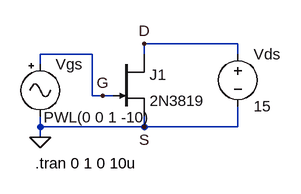
[diagram p0: schematic Draft2.asc]
Draft2.asc, the LTspice schematic file:
Version 4
SHEET 1 880 680
WIRE 384 96 240 96
WIRE 160 112 80 112
WIRE 240 112 240 96
WIRE 384 112 384 96
WIRE 80 128 80 112
WIRE 160 176 160 112
WIRE 176 176 160 176
WIRE 192 176 176 176
WIRE 80 224 80 208
WIRE 240 224 240 208
WIRE 240 224 80 224
WIRE 384 224 384 192
WIRE 384 224 240 224
WIRE 80 240 80 224
FLAG 80 240 0
FLAG 176 176 G
FLAG 240 96 D
FLAG 240 224 S
SYMBOL njf 192 112 R0
SYMATTR InstName J1
SYMATTR Value 2N3819
SYMBOL voltage 384 96 R0
WINDOW 123 0 0 Left 0
WINDOW 39 0 0 Left 0
SYMATTR InstName Vds
SYMATTR Value 15
SYMBOL Misc\\signal 80 112 R0
WINDOW 3 5 97 Left 2
WINDOW 123 0 0 Left 0
WINDOW 39 0 0 Left 0
SYMATTR InstName Vgs
SYMATTR Value PWL(0 0 1 -10)
TEXT 72 280 Left 2 !.tran 0 1 0 10u

The netlist it stands for:
* Draft2.asc
J1 D G 0 2N3819
Vds D 0 15
Vgs G 0 PWL(0 0 1 -10)
.model NJF NJF
.model PJF PJF
.lib standard.jft
.tran 0 1 0 10u
.backanno
.end

* Results of the author's LTspice run, read from the files saved beside the schematic
* Operating Point, zero values left out:
*   V(d) = 15 V
*   Id(J1) = 12.03 mA
*   Ig(J1) = -16.06 pA
*   Is(J1) = -12.03 mA
*   I(Vds) = -12.03 mA
*   I(Vgs) = 16.06 pA
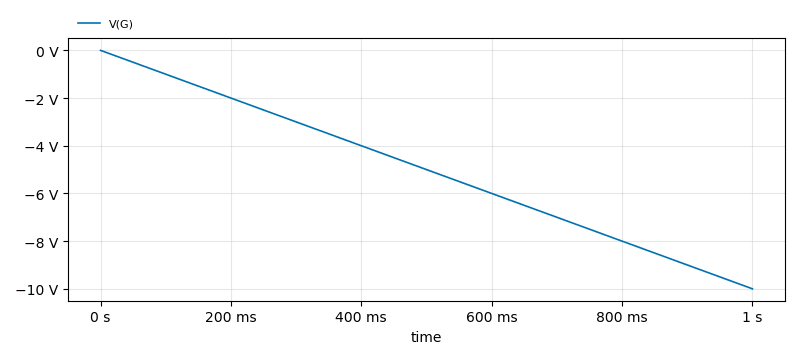
[diagram p1: Transient Analysis of Draft2.asc, plotted from the saved traces]
* Transient Analysis, 1 run:
*   V(G): min -10 V, max 0 V, average -5 V, rms 5.774 V, last -10 V